# EasyEDA Pro project Variometer.epro

# Schematic Schematic1
Board Name: Board1; Create Date: 2026-03-16; Page Name: P1; Project Name: Variometer; Schematic Name: Schematic1; Update Date: 2026-03-25; Company: EasyEDA.com; Page Size: A4; Version: V1.0
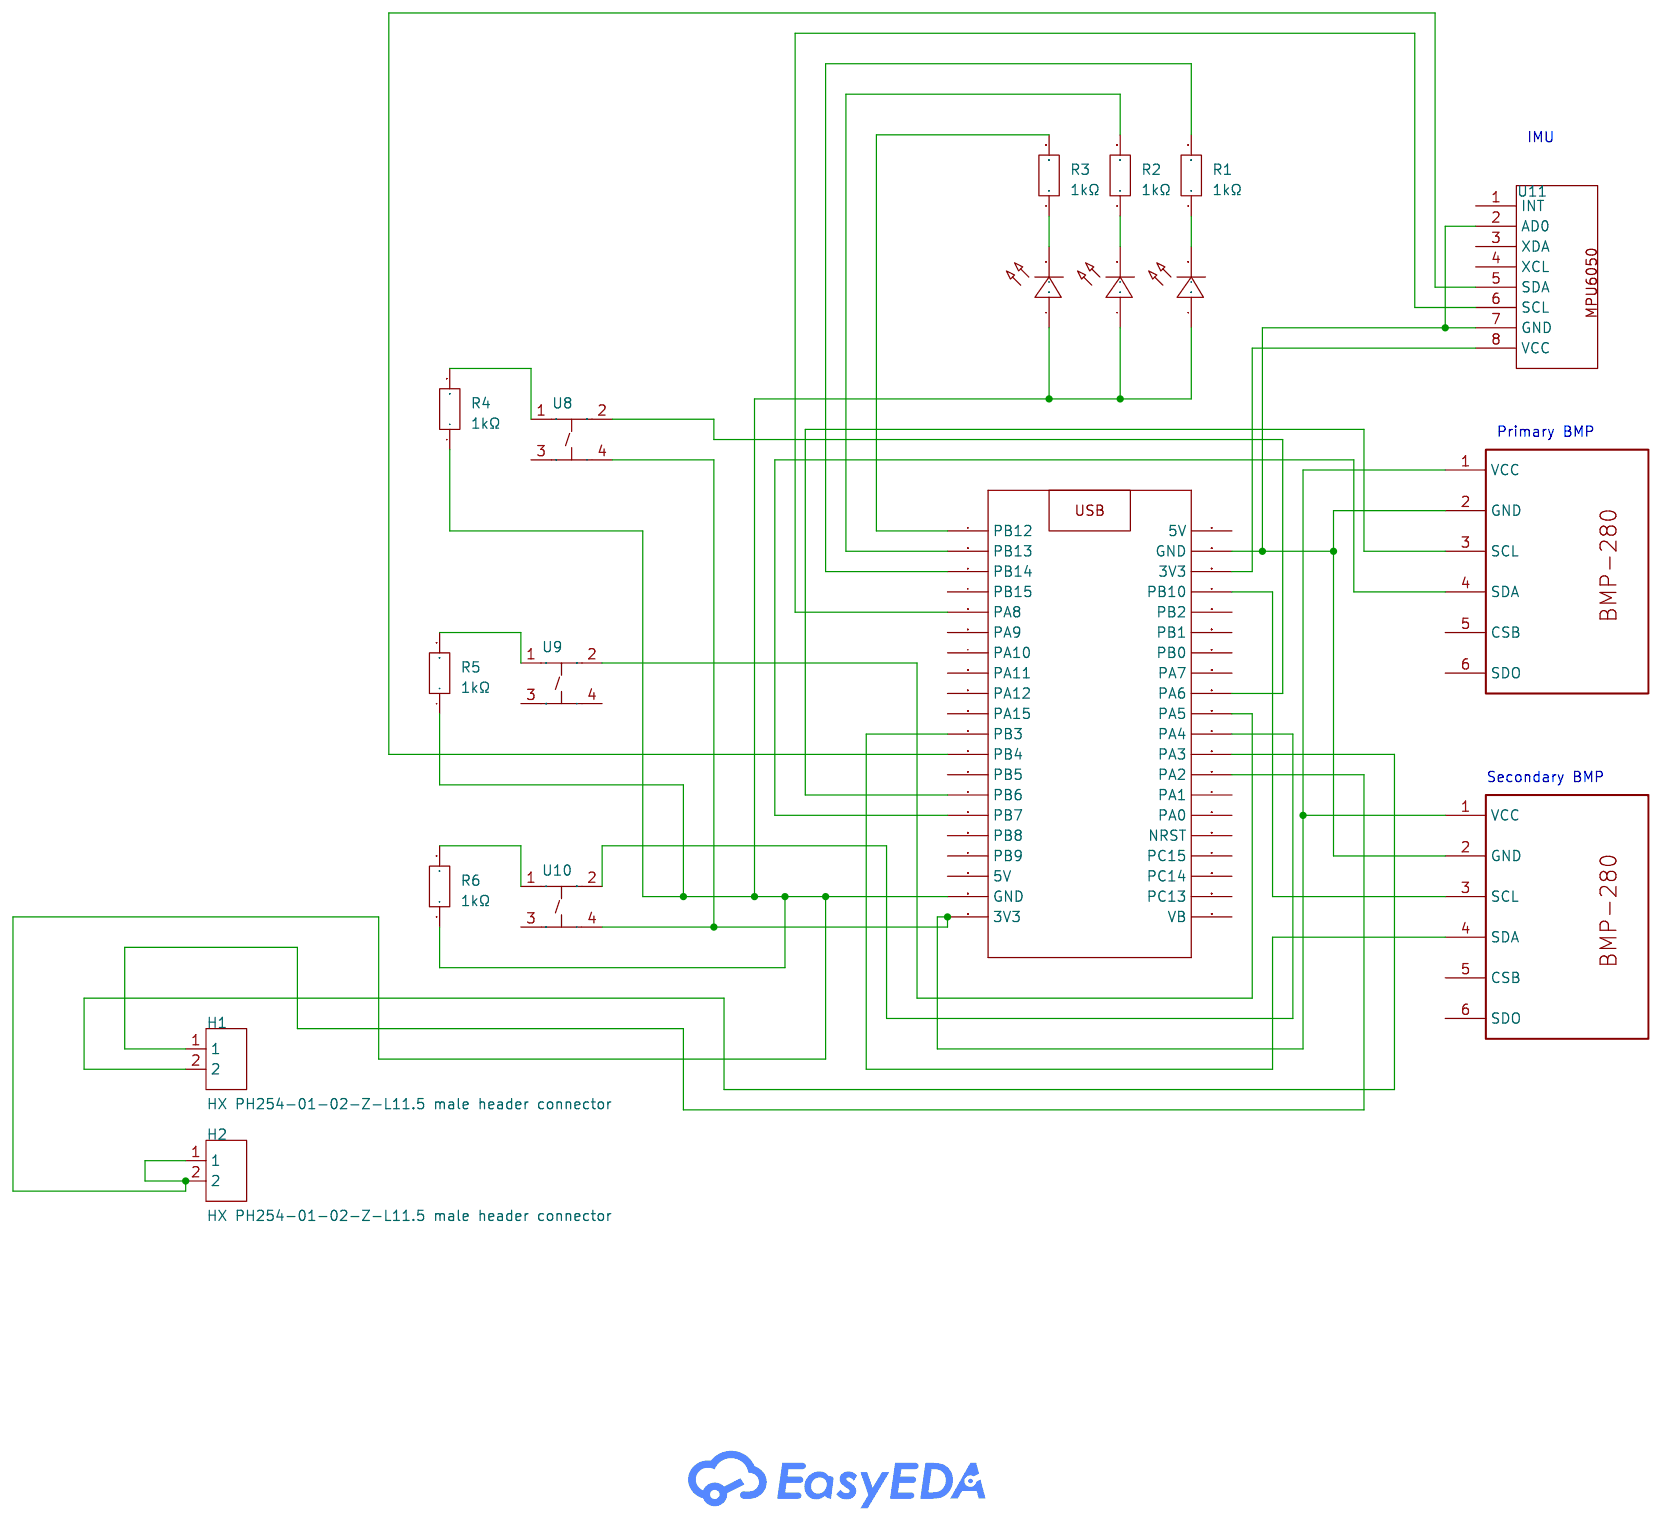
[diagram p0: schematic sheet]

## Parts
H1  HX PH254-01-02-Z-L11.5 male header connector  [HDR-TH_2P-P2.54-V-M]
H2  HX PH254-01-02-Z-L11.5 male header connector  [HDR-TH_2P-P2.54-V-M]
LED1  -  [LED-TH_BD3.0-P2.54-FD]
LED2  -  [LED-TH_BD3.0-P2.54-FD]
LED3  -  [LED-TH_BD3.0-P2.54-FD]
R1  1kΩ  [RES-TH_BD2.7-L6.2-P10.20-D0.4]
R2  1kΩ  [RES-TH_BD2.7-L6.2-P10.20-D0.4]
R3  1kΩ  [RES-TH_BD2.7-L6.2-P10.20-D0.4]
R4  1kΩ  [RES-TH_BD2.7-L6.2-P10.20-D0.4]
R5  1kΩ  [RES-TH_BD2.7-L6.2-P10.20-D0.4]
R6  1kΩ  [RES-TH_BD2.7-L6.2-P10.20-D0.4]
U5  -  [PCB_BLACK_PILL_V2]
U6  BMP280  [BMP280FOOTPRINT]
U7  BMP280  [BMP280FOOTPRINT]
U8  YZA-072-10.0  [SW-SMD_4P-L6.0-W6.0-P4.5-LS9.0-YZA-072-10.0]
U9  YZA-072-10.0  [SW-SMD_4P-L6.0-W6.0-P4.5-LS9.0-YZA-072-10.0]
U10  YZA-072-10.0  [SW-SMD_4P-L6.0-W6.0-P4.5-LS9.0-YZA-072-10.0]
U11  -  [HDR-TH_8P-P2.54-V-F-1]

## Library data of the parts
H1 H2 = HX PH254-01-02-Z-L11.5 male header connector: Pin Structure:1x2P Pitch:2.54mm Circluar Pins/Square Pins:Pin Header Mounting Type:Through Hole Number of Rows:1 Number of Pins:2P Current Rating:3A Voltage Rating (Max):1kV Length of Mating Pin:6mm Insulation Height:2.5mm Length of End Connection Pin:3mm; LCSC Part Name: 1x2P 间距:2.54mm 方针 直插; Supplier Part: C52016390; Manufacturer: hanxia(韩下); Supplier Footprint: 插件,P=2.54mm; JLCPCB Part Class: Extended Part; Datasheet: https://item.szlcsc.com/datasheet/HX%2520PH254-01-02-Z-L11.5%2520male%2520header%2520connector/54760435.html; Supplier: LCSC; Pin Structure: 1x2P; Pitch: 2.54mm; Circluar Pins/Square Pins: Pin Header; Mounting Type: Through Hole; Number of Rows: 1; Number of Pins: 2P; Current Rating: 3A; Voltage Rating (Max): 1kV; Length of Mating Pin: 6mm; Insulation Height: 2.5mm; Length of End Connection Pin: 3mm; Contact Material: Brass; Contact Plating: Gold; Operating Temperature: -40℃~+105℃
LED1-LED3 = LED_TH-R_3mm: Supplier Footprint: Through
R1-R6 = MF1/4W-1K±1%-ST52: Type:Metal Film Resistor Resistance:1kΩ Tolerance:±1% Tolerance:±1% Voltage-Supply(Max):250V Power(Watts):250mW Temperature Coefficient:±100ppm/℃ Temperature Coefficient:±100ppm/℃ Operating Temperature:-55℃~+155℃ Operating Temperature:-55℃~+155℃; LCSC Part Name: 金属膜电阻 1kΩ ±1% 250mW; Supplier Part: C2903245; Manufacturer: VO(翔胜); Supplier Footprint: 插件,D2.7xL6.2mm; JLCPCB Part Class: Extended Part; Datasheet: https://item.szlcsc.com/datasheet/MF1%252F4W-1K%25C2%25B11%2525-ST52/3158996.html; Supplier: LCSC; Type: Metal Film Resistor; Tolerance: ±1%; Voltage-Supply(Max): 250V; Power(Watts): 250mW; Temperature Coefficient: ±100ppm/℃; Operating Temperature: -55℃~+155℃
U5 = BLACKPILL: _: 3
U6 U7 = BMP280
U8-U10 = YZA-072-10.0: PressForce:260gf Switch Size:6*6*10.0MM Installation Method:正按 RatedCurrent:50mA ButtonShape:Rectangle button Circuit:SPST Lifetime:5万次 Type:轻触开关; LCSC Part Name: YIZHI(逸致) YZA-072-10.0 6*6*10.0MM贴片SMD四脚正按; Supplier Part: C49108668; Manufacturer: YIZHI(逸致); JLCPCB Part Class: Extended Part; Datasheet: https://item.szlcsc.com/datasheet/YZA-072-10.0/51487285.html; Supplier: LCSC; PressForce: 260gf; Switch Size: 6*6*10.0MM; Installation Method: 正按; RatedCurrent: 50mA; ButtonShape: Rectangle button; Circuit: SPST; Lifetime: 5万次; Type: 轻触开关
U11 = MPU6050: Gyro + Accelerometer

## Nets
$1N272: U5.20(3V3) U6.1(VCC) U7.1(VCC) U8.4 U10.4
$1N332: U5.14(PB6) U6.3(SCL)
$1N343: U5.15(PB7) U6.4(SDA)
$1N352: U5.24(PB10) U7.3(SCL)
$1N358: U5.11(PB3) U7.4(SDA)
$1N609: LED1.2(A) R1.1
$1N613: LED2.2(A) R2.1
$1N618: LED3.2(A) R3.1
$1N664: R3.2 U5.1(PB12)
$1N670: R2.2 U5.2(PB13)
$1N681: R1.2 U5.3(PB14)
$1N1096: R6.2 U10.1
$1N1107: R5.2 U9.1
$1N1112: R4.2 U8.1
$1N1131: U5.31(PA4) U10.2
$1N1733: U5.29(PA6) U8.2
$1N1741: U5.30(PA5) U9.2
$1N2154: U5.23(3V3) U11.8(VCC)
$1N2175: U5.5(PA8) U11.6(SCL)
$1N2186: U5.12(PB4) U11.5(SDA)
$1N2331: H1.1 U5.33(PA2)
$1N2343: H1.2 U5.32(PA3)
Net-(H2-1): H2.1 H2.2 LED1.1(C) LED2.1(C) LED3.1(C) R4.1 R5.1 R6.1 U5.19(GND)
Net-(U5-22): U5.22(GND) U6.2(GND) U7.2(GND) U11.2(AD0) U11.7(GND)

Not connected (* = marked no-connect by the designer): U5 4(PB15) 6(PA9) 7(PA10) 8(PA11) 9(PA12) 10(PA15) 13(PB5) 16(PB8) 17(PB9) 18(5V) 21(5V) 25(PB2) 26(PB1) 27(PB0) 28(PA7) 34(PA1) 35(PA0) 36(NRST) 37(PC15) 38(PC14) 39(PC13) 40(VB); U6 5(CSB) 6(SDO); U7 5(CSB) 6(SDO); U8 3; U9 3 4; U10 3; U11 1(INT) 3(XDA) 4(XCL)

## Notes on the sheet
- IMU
- Primary BMP
- Secondary BMP

# Board PCB1
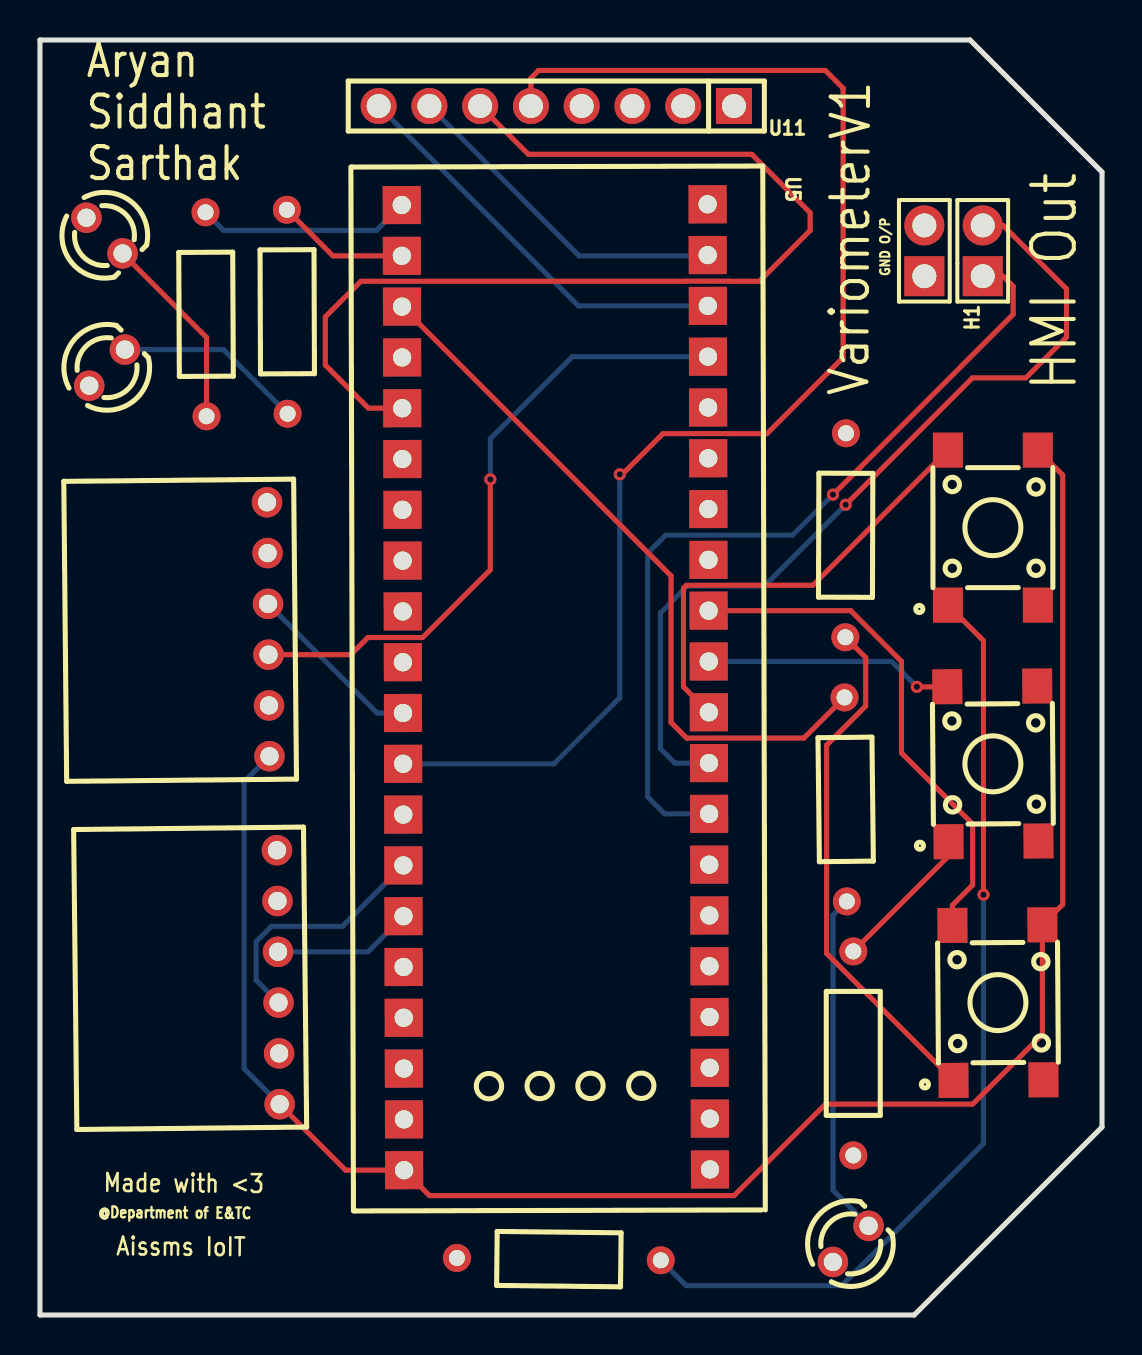
[diagram p1: board, top side]
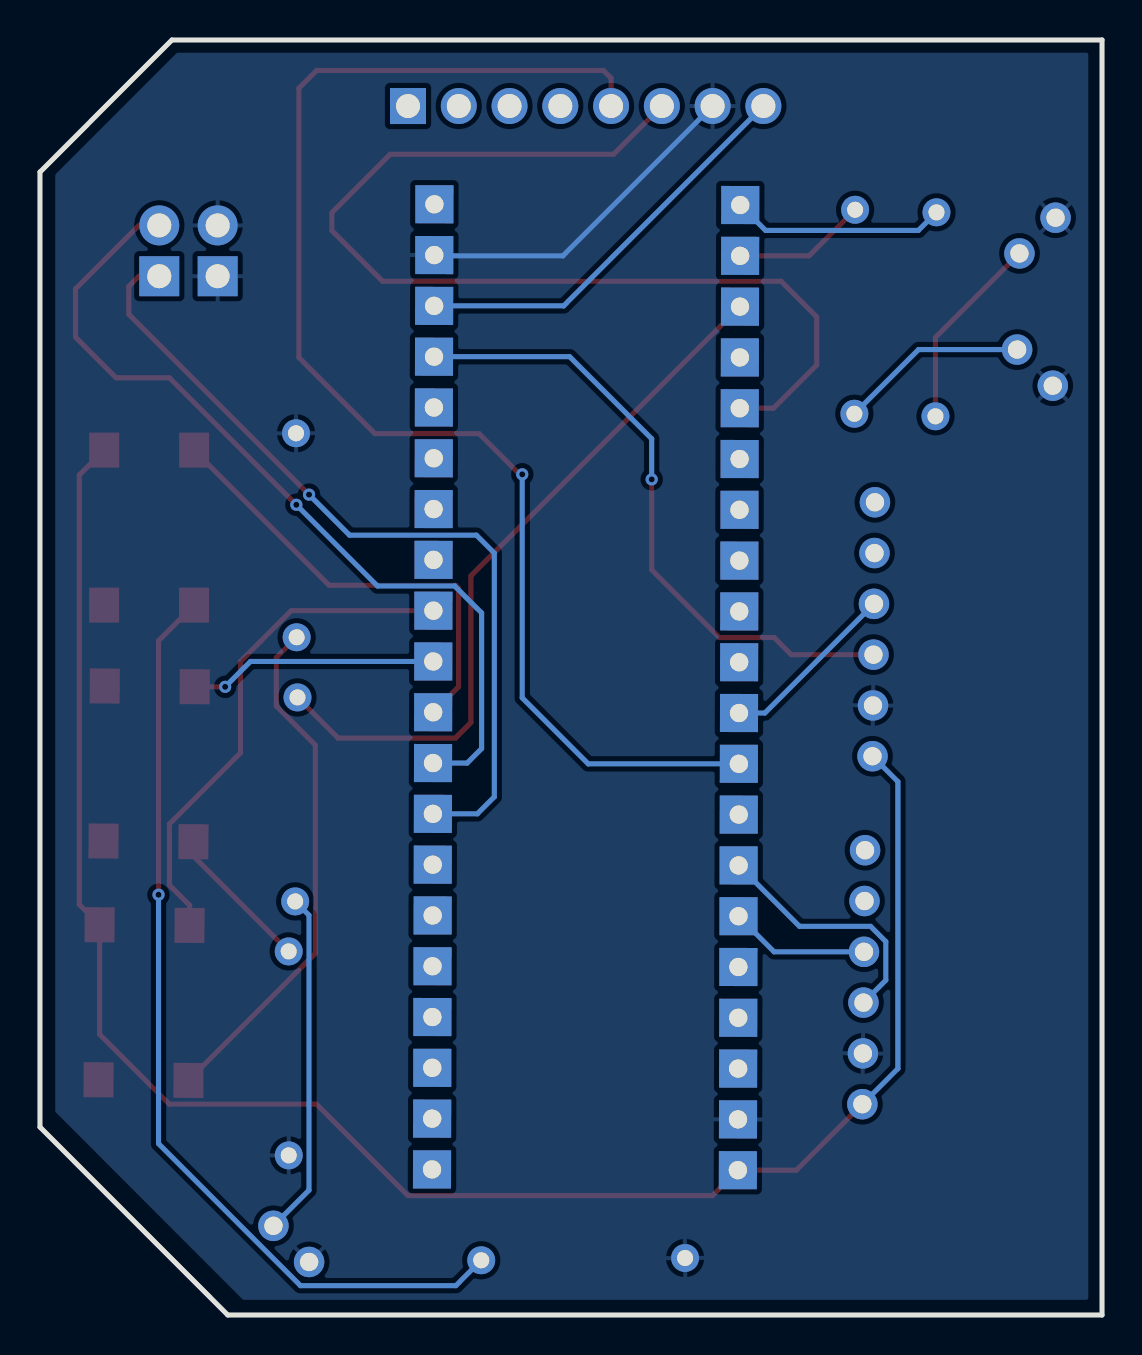
[diagram p2: board, bottom side, seen from below]

Outline 53.14 x 63.75 mm; copper layers: Top Layer, Bottom Layer. Coordinates in mm from the lower left corner of the outline.
Outline path: 0,63.75 46.54,63.75 53.14,57.15 53.14,9.4 43.74,0 0,0 0,63.75
Stack: Top Layer 0.035mm / Dielectric1 1.51mm FR4 er 4.5 / Bottom Layer 0.035mm

## Design rules (mm)
template: JLCPCB Capability(Two Layers Board)
spacing copperThickness1oz (default): track to track 0.102, other pairs 0.152 to 0.3
spacing copperThickness2oz: track to track 0.203, other pairs 0.152 to 0.3
track width copperThickness1oz (default): min 0.127, default 0.254, max 2.54
track width copperThickness2oz: min 0.203, default 0.254, max 2.54
differential pair differentialPair (default): width min 0.127, default 0.254, max 2.54; gap min 0.152, default 0.152
via viaSize (default): diameter min 0.5, default 0.61, max 10; hole min 0.3, default 0.305, max 6.3

## Placement (name value [footprint] x y rotation side)
GND O/P  HX PH254-01-02-Z-L11.5 male header connector  [HDR-TH_2P-P2.54-V-M]  44.25 53.21 90 top
H1  HX PH254-01-02-Z-L11.5 male header connector  [HDR-TH_2P-P2.54-V-M]  47.17 53.21 90 top
LED1  -  [LED-TH_BD3.0-P2.54-FD]  40.57 3.56 45.3 top
LED2  -  [LED-TH_BD3.0-P2.54-FD]  3.36 47.37 45.3 top
LED3  -  [LED-TH_BD3.0-P2.54-FD]  3.23 53.98 315.3 top
R1  1kΩ  [RES-TH_BD2.7-L6.2-P10.20-D0.4]  40.31 25.78 90.6 top
R2  1kΩ  [RES-TH_BD2.7-L6.2-P10.20-D0.4]  12.37 50.17 90.2 top
R3  1kΩ  [RES-TH_BD2.7-L6.2-P10.20-D0.4]  8.31 50.04 90.3 top
R4  1kΩ  [RES-TH_BD2.7-L6.2-P10.20-D0.4]  40.31 38.99 269.8 top
R5  1kΩ  [RES-TH_BD2.7-L6.2-P10.20-D0.4]  40.69 13.08 90 top
R6  1kΩ  [RES-TH_BD2.7-L6.2-P10.20-D0.4]  25.96 2.79 359.4 top
U5  -  [PCB_BLACK_PILL_V2]  15.55 57.4 270.1 top
U6  BMP280  [BMP280FOOTPRINT]  11.99 10.54 0.6 top
U7  BMP280  [BMP280FOOTPRINT]  11.48 27.94 0.5 top
U8  YZA-072-10.0  [SW-SMD_4P-L6.0-W6.0-P4.5-LS9.0-YZA-072-10.0]  47.93 15.62 90.4 top
U9  YZA-072-10.0  [SW-SMD_4P-L6.0-W6.0-P4.5-LS9.0-YZA-072-10.0#2]  47.68 27.56 90.5 top
U10  YZA-072-10.0  [SW-SMD_4P-L6.0-W6.0-P4.5-LS9.0-YZA-072-10.0#2]  47.68 39.37 90 top
U11  -  [HDR-TH_8P-P2.54-V-F-1]  25.83 60.45 180 top

## Footprints (pads in the part's own frame, mm; a bottom-side part is the same pattern mirrored in y, then rotated)
BMP280FOOTPRINT
  round 1.524 hole 0.914: 1(0,0) 2(0,2.54) 3(0,5.08) 4(0,7.62) 5(0,10.16) 6(0,12.7)
HDR-TH_2P-P2.54-V-M
  rect 2x2 hole 1.2: 1(-1.27,0)
  round 2 hole 1.2: 2(1.27,0)
HDR-TH_8P-P2.54-V-F-1
  rect 1.8x1.8 hole 1.2: 1(-8.89,0)
  round 1.8 hole 1.2: 2(-6.35,0) 3(-3.81,0) 4(-1.27,0) 5(1.27,0) 6(3.81,0) 7(6.35,0) 8(8.89,0)
LED-TH_BD3.0-P2.54-FD
  round 1.524 hole 0.914: 1(-1.27,0) 2(1.27,0)
PCB_BLACK_PILL_V2
  rect 1.905x1.905 hole 0.914: 1(1.909,2.549) 2(4.449,2.549) 3(6.989,2.549) 4(9.529,2.549) 5(12.069,2.549) 6(14.609,2.549) 7(17.149,2.549) 8(19.689,2.549) 9(22.229,2.549) 10(24.769,2.549) 11(27.309,2.549) 12(29.849,2.549) 13(32.389,2.549) 14(34.929,2.549) 15(37.469,2.549) 16(40.009,2.549) 17(42.549,2.549) 18(45.089,2.549) 19(47.629,2.549) 20(50.169,2.549) 21(1.909,17.852) 22(4.449,17.852) 23(6.989,17.852) 24(9.529,17.852) 25(12.069,17.852) 26(14.609,17.852) 27(17.149,17.852) 28(19.689,17.852) 29(22.229,17.852) 30(24.769,17.852) 31(27.309,17.852) 32(29.849,17.852) 33(32.389,17.852) 34(34.929,17.852) 35(37.469,17.852) 36(40.009,17.852) 37(42.549,17.852) 38(45.089,17.852) 39(47.629,17.852) 40(50.169,17.852)
RES-TH_BD2.7-L6.2-P10.20-D0.4
  round 1.4 hole 0.8: 1(-5.1,0) 2(5.1,0)
SW-SMD_4P-L6.0-W6.0-P4.5-LS9.0-YZA-072-10.0
  rect 1.75x1.5 smd: 1(-3.875,2.25) 2(3.875,2.25) 3(-3.875,-2.25) 4(3.875,-2.25)
SW-SMD_4P-L6.0-W6.0-P4.5-LS9.0-YZA-072-10.0#2
  rect 1.75x1.5 smd: 1(-3.875,2.25) 2(3.875,2.25) 3(-3.875,-2.25) 4(3.875,-2.25)

## Nets
As in the schematic, except:
$1N295: GND O/P.1 GND O/P.2 LED1.1 LED2.1 LED3.1 R4.1 R5.1 R6.1 U5.19 U5.22 U6.2 U7.2 U11.7

Pads without a net: U5 4 6 7 8 9 10 13 16 17 18 21 25 26 27 28 34 35 36 37 38 39 40; U6 5 6; U7 5 6; U8 3; U9 3 4; U10 3; U11 1 2 3 4

## Via types
v1: diameter 0.61, hole 0.305, Top Layer to Bottom Layer, 6 vias

## Routing (per net, layer and track width the routed paths; a pad name or vN(x,y) marks a point on that pad's centre or on a via; arc(x,y) is an arc through that point)
$1N272: length 92.2
  Top Layer w0.254: U10.4 51.17,42 51.17,20.53 U8.4 50.16,14.03 46.67,10.54 39.3,10.54 34.73,5.97 19.49,5.97 U5.20 15.29,7.24 U6.1
  Bottom Layer w0.254: U7.1 10.21,26.67 10.21,12.32 U6.1
$1N295: length 17
  Bottom Layer w0.254: U5.22 33.37,52.96 26.98,52.96 U11.7
$1N332: length 12.5
  Bottom Layer w0.254: U5.14 15.14,19.43 11.58,19.43 10.82,18.67 10.82,16.74 U6.3
$1N343: length 7
  Bottom Layer w0.254: U6.4 16.41,18.16 18.19,19.94
$1N352: length 32
  Top Layer w0.254: 11.43,33.02 15.55,33.02 16.4,33.88 19.14,33.88 22.53,37.26 v1(22.53,41.78)
  Bottom Layer w0.254: v1(22.53,41.78) 22.53,43.81 26.64,47.92 U5.24
$1N358: length 9
  Bottom Layer w0.254: U7.4 16.87,30.1 U5.11
$1N609: length 17.2
  Bottom Layer w0.254: LED1.2 39.68,6.24 39.68,19.99 R1.1
$1N613: length 9.5
  Bottom Layer w0.254: R2.1 9.18,48.27 LED2.2
$1N618: length 9.9
  Top Layer w0.254: LED3.2 8.33,48.88 R3.1
$1N664: length 10.7
  Bottom Layer w0.254: 8.28,55.14 9.19,54.23 16.83,54.23 U5.1
$1N670: length 6.7
  Top Layer w0.254: U5.2 14.66,52.96 12.35,55.27
$1N681: length 36.2
  Top Layer w0.254: U5.3 31.58,36.96 31.58,29.63 32.36,28.85 38.22,28.85 R1.2
$1N1096: length 47.3
  Top Layer w0.254: U10.1 47.21,33.72 v1(47.21,21.02)
  Bottom Layer w0.254: R6.2 32.33,1.47 40.11,1.47 47.21,8.57 v1(47.21,21.02)
$1N1107: length 7.5
  Top Layer w0.254: 40.7,18.18 45.46,22.95 U9.1
$1N1112: length 26
  Top Layer w0.254: U8.1 39.36,18.08 39.36,28.49 41.31,30.45 41.31,32.87 R4.2
$1N1131: length 22.8
  Top Layer w0.254: U10.2 38.67,36.49 32.34,36.49 32.2,36.34 32.2,31.41 U5.31
$1N1733: length 25.8
  Top Layer w0.254: U8.2 45.65,20.49 46.66,21.5 46.66,24.55 43.11,28.11 43.11,32.68 40.57,35.22 U5.29
$1N1741: length 12.5
  Top Layer w0.254: v1(43.88,31.41) 45.39,31.41
  Bottom Layer w0.254: v1(43.88,31.41) 42.61,32.68 U5.30
$1N2154: length 20.6
  Bottom Layer w0.254: U11.8 26.94,50.46 U5.23
$1N2175: length 52.8
  Top Layer w0.254: U5.5 16.43,45.34 14.28,47.5 14.28,49.91 16.06,51.69 32.35,51.69 32.35,51.69 34.48,51.69 34.49,51.69 35.99,51.69 38.54,54.23 38.54,55.12 35.61,58.04 24.44,58.04 U11.6
$1N2186: length 68
  Top Layer w0.254: v1(29.01,42.04) 29.14,42.04 31.17,44.07 32.37,44.07 32.37,44.07 34.5,44.07 34.51,44.07 36.38,44.07 40.19,47.88 40.19,61.34 39.3,62.23 24.95,62.23 24.56,61.85 U11.5
  Bottom Layer w0.254: v1(29.01,42.04) 29.01,30.86 25.71,27.56 18.17,27.56 U5.12
$1N2331: length 42
  Top Layer w0.254: v1(39.68,41.02) 48.7,50.04 48.7,51.44 48.19,51.94 47.17,51.94
  Bottom Layer w0.254: U5.33 31.26,25.06 30.41,25.91 30.41,38.1 31.3,38.99 37.65,38.99 v1(39.68,41.02)
$1N2343: length 43.5
  Top Layer w0.254: v1(40.31,40.51) 46.66,46.86 49.33,46.86 51.36,48.9 51.36,51.31 48.19,54.48 H1.2
  Bottom Layer w0.254: v1(40.31,40.51) 36.25,36.45 32.39,36.45 31.04,35.11 31.04,28.32 31.76,27.6 U5.32

## Copper pours and planes (outline as drawn; the poured copper is in the pictures)
$1N295 on Bottom Layer: 0.69,63.25 0.69,0.89 0.56,0.76 42.98,0.76 52.38,10.16 52.38,57.02 46.28,63.12 0.82,63.12

## Text on the board
Top Silkscreen Layer: @Department of E&TC | Made with <3 | Aissms IoIT | Aryan / Siddhant / Sarthak | VariometerV1 | HMI Out
